# EAGLE design faun-node-connector (EAGLE 7.2.0)
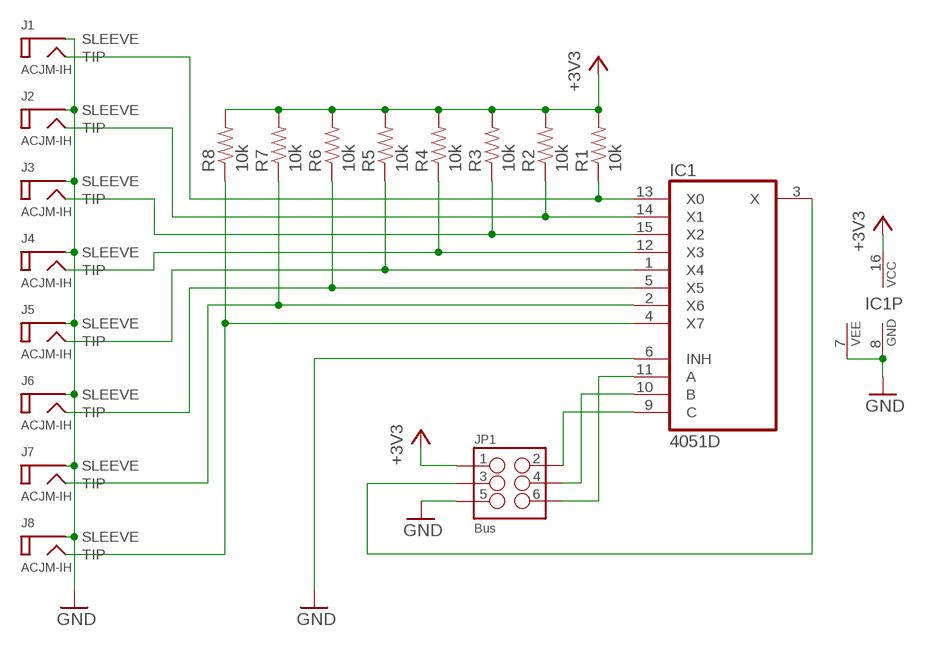
[diagram p0: schematic, sheet 1]

## Parts
IC1  4051D  [SO16]
J1  ACJM-IH  [ACJM-IH]
J2  ACJM-IH  [ACJM-IH]
J3  ACJM-IH  [ACJM-IH]
J4  ACJM-IH  [ACJM-IH]
J5  ACJM-IH  [ACJM-IH]
J6  ACJM-IH  [ACJM-IH]
J7  ACJM-IH  [ACJM-IH]
J8  ACJM-IH  [ACJM-IH]
JP1  Bus  M03X22X3_SILK_SM  [2X3]
R1  10k  RESISTOR1206  [1206]
R2  10k  RESISTOR1206  [1206]
R3  10k  RESISTOR1206  [1206]
R4  10k  RESISTOR1206  [1206]
R5  10k  RESISTOR1206  [1206]
R6  10k  RESISTOR1206  [1206]
R7  10k  RESISTOR1206  [1206]
R8  10k  RESISTOR1206  [1206]

## Nets
GND: IC1.6(INH) IC1.7(VEE) IC1.8(GND) J1.SLEEVE@1(SLEEVE) J1.SLEEVE@2(SLEEVE) J2.SLEEVE@1(SLEEVE) J2.SLEEVE@2(SLEEVE) J3.SLEEVE@1(SLEEVE) J3.SLEEVE@2(SLEEVE) J4.SLEEVE@1(SLEEVE) J4.SLEEVE@2(SLEEVE) J5.SLEEVE@1(SLEEVE) J5.SLEEVE@2(SLEEVE) J6.SLEEVE@1(SLEEVE) J6.SLEEVE@2(SLEEVE) J7.SLEEVE@1(SLEEVE) J7.SLEEVE@2(SLEEVE) J8.SLEEVE@1(SLEEVE) J8.SLEEVE@2(SLEEVE) JP1.5
N$1: IC1.13(X0) J1.TIP@1(TIP) J1.TIP@2(TIP) R1.1
N$2: IC1.14(X1) J2.TIP@1(TIP) J2.TIP@2(TIP) R2.1
N$3: IC1.15(X2) J3.TIP@1(TIP) J3.TIP@2(TIP) R3.1
N$4: IC1.12(X3) J4.TIP@1(TIP) J4.TIP@2(TIP) R4.1
N$5: IC1.1(X4) J5.TIP@1(TIP) J5.TIP@2(TIP) R5.1
N$6: IC1.5(X5) J6.TIP@1(TIP) J6.TIP@2(TIP) R6.1
N$7: IC1.2(X6) J7.TIP@1(TIP) J7.TIP@2(TIP) R7.1
N$8: IC1.4(X7) J8.TIP@1(TIP) J8.TIP@2(TIP) R8.1
N$9: IC1.9(C) JP1.2
N$10: IC1.10(B) JP1.4
N$11: IC1.11(A) JP1.6
N$12: IC1.3(X) JP1.3
VCC: IC1.16(VCC) JP1.1 R1.2 R2.2 R3.2 R4.2 R5.2 R6.2 R7.2 R8.2 ; supply symbol labelled +3V3

## Library data of the parts
IC1 = 40xx:4051: 8-channel ANALOG MULTIPLEXER
J1-J8 = faun:ACJM-IH: 1/4” (6.35mmø) Jack, Horizontal PCB mount, Plastic housing and Bezel with threaded Metal nut.
JP1 = SparkFun-Connectors:M03X2: 2x3 .1" header. Shrouded, with keying- CONN-10681 SMT- CONN-11415 Pogo pins- HW-11044
R1-R8 = SparkFun-Resistors:RESISTOR: Resistor Basic schematic elements and footprints for 0603, 1206, and PTH resistors.

## Board
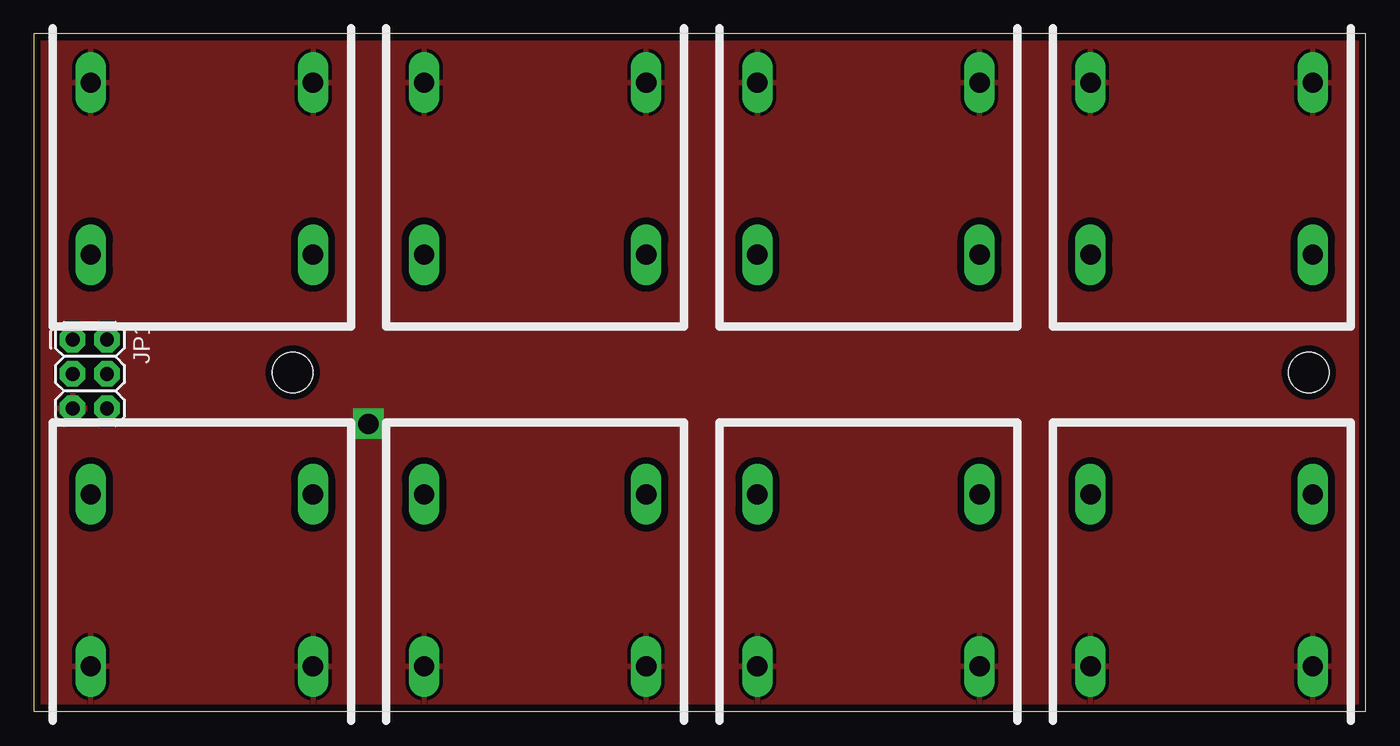
[diagram p1: board, top side]
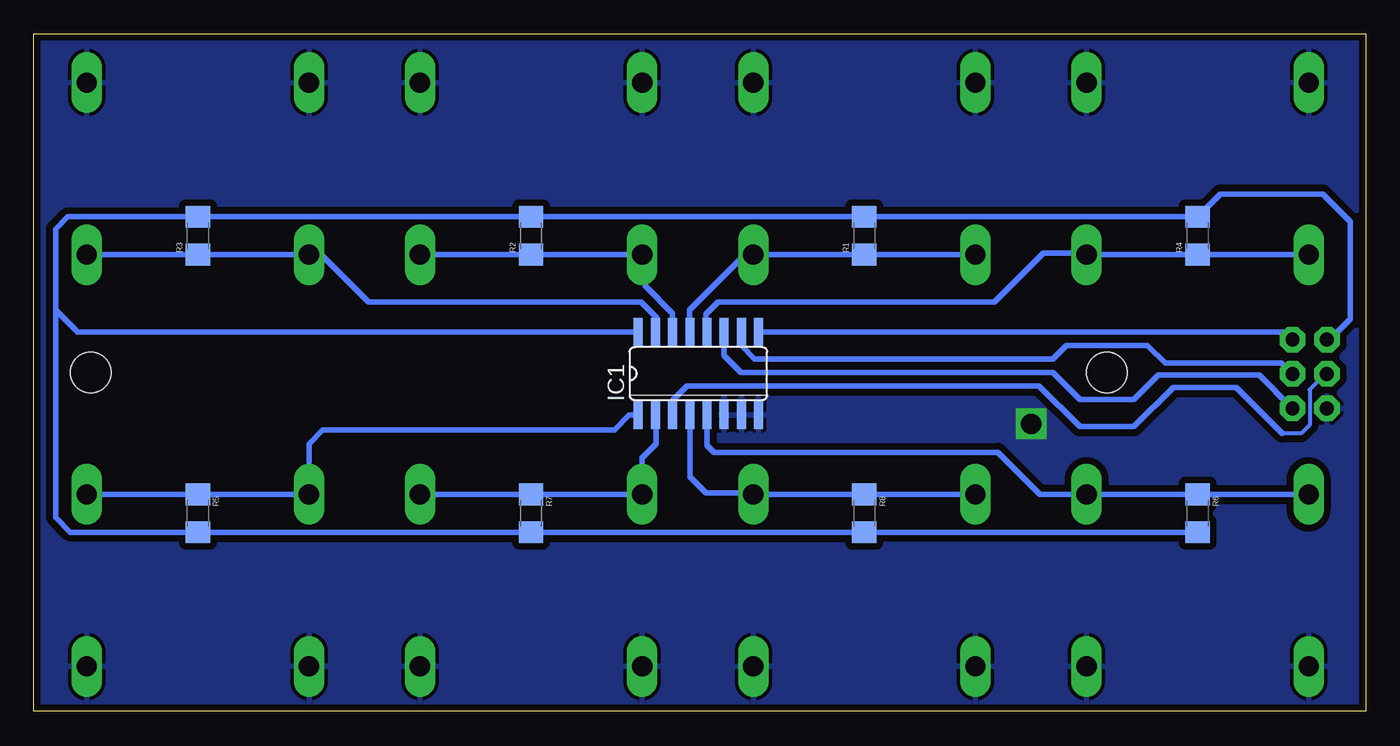
[diagram p2: board, bottom side, seen from below]

Size 98.3 x 50 mm. Coordinates in mm from the lower left corner, seen from the top.
Outline: 0,0 98.3,0 98.3,50 0,50 0,0
Copper layers (1*16): Top 0.035mm / dielectric 1.5mm / Bottom 0.035mm
Design rules "SeeedStudio_2layer_DRU_no_angle_20140221": minimum track width 6mil, minimum drill 12mil, track to track 6mil, track to pad 6mil, pad to pad 6mil, via to via 6mil, smd to smd 0mil, copper to edge 10mil, drill to drill 10mil, minimum pad ring 10mil, minimum via ring 6mil, stop-mask expansion 2mil, vias tented up to drill 100mil, thermal gap 10mil
Holes 3 mm at 94.1,25 19.1,25

### Footprints (pad centres in the part's own frame; a part is rotated, then mirrored left to right if it is on the bottom)
SO16 = smd 0.66 x 2.032: 1 -4.445,-3.073; 2 -3.175,-3.073; 3 -1.905,-3.073; 4 -0.635,-3.073; 5 0.635,-3.073; 6 1.905,-3.073; 7 3.175,-3.073; 8 4.445,-3.073; 9 4.445,3.073; 10 3.175,3.073; 11 1.905,3.073; 12 0.635,3.073; 13 -0.635,3.073; 14 -1.905,3.073; 15 -3.175,3.073; 16 -4.445,3.073
ACJM-IH = drill 1.5 long: SLEEVE@1 0,8.2; SLEEVE@2 0,-8.2; TIP@1 -12.7,8.2; TIP@2 -12.7,-8.2
2X3 = drill 1.016 pad 1.88 octagon: 1 0,0; 2 0,2.54; 3 2.54,0; 4 2.54,2.54; 5 5.08,0; 6 5.08,2.54
1206 = smd 1.6 x 1.8: 1 -1.4,0; 2 1.4,0

### Placement (x,y rotation side)
IC1  49.25,24.92 0 bottom
J1  37,46.4 90 top
J2  61.6,46.4 90 top
J3  86.2,46.4 90 top
J4  12.4,46.4 90 top
J5  86.2,3.3 270 top
J6  12.4,3.3 270 top
J7  61.6,3.3 270 top
J8  37,3.3 270 top
JP1  2.86,27.43 270 top
R1  37,35.1 90 bottom
R2  61.6,35.1 90 bottom
R3  86.2,35.1 90 bottom
R4  12.4,35.1 90 bottom
R5  86.2,14.6 270 bottom
R6  12.4,14.6 270 bottom
R7  61.6,14.6 270 bottom
R8  37,14.6 270 bottom

### Tracks (layer width: path | path; a pad name or v marks a point on that pad's centre or on a via)
GND  (via drill 1.5)
  other vias: 24.7,21.2
  pour Bottom (isolate 0.5): 101.5,62 101.2,-10.6 -5.3,-10.3 -5.3,61.7
  pour Top (isolate 0.5): 110.2,62.3 109.9,-10.3 -15.5,-9.7 -15.5,62.3
N$1
  Bottom 0.406: J1.TIP@1 R1.1 J1.TIP@2 45.8,33.7 49.9,29.6 49.9,28.01 IC1.13
N$2
  Bottom 0.406: J2.TIP@2 R2.1 J2.TIP@1 53.2,33.5 53.2,31.4 51.16,29.35 IC1.14
N$3
  Bottom 0.406: J3.TIP@2 R3.1 J3.TIP@1 77.1,33.7 73.6,30.2 53.5,30.2 52.3,29 52.3,28.12 IC1.15
N$4
  Bottom 0.406: J4.TIP@1 R4.1 J4.TIP@2 20.7,33.8 23.8,33.8 27.4,30.2 47.8,30.2 48.7,29.3 48.7,28.08 IC1.12
N$5
  Bottom 0.406: J5.TIP@1 R5.1 J5.TIP@2 78,19.73 76.97,20.75 55.45,20.75 54.35,21.85 IC1.1
N$6
  Bottom 0.406: J6.TIP@2 R6.1 J6.TIP@1 24.05,16 27.15,19.1 48.1,19.1 48.62,19.61 IC1.5
N$7
  Bottom 0.406: J7.TIP@1 R7.1 J7.TIP@2 53.4,18.7 52.38,19.73 52.38,21.8 IC1.2
N$8
  Bottom 0.406: J8.TIP@2 R8.1 J8.TIP@1 45.3,16.1 48.7,16.1 49.88,17.29 IC1.4
N$9
  Bottom 0.406: IC1.9 5.96,27.99 JP1.2
N$10
  Bottom 0.406: JP1.4 6.21,25.7 14.8,25.7 16.1,27 22.1,27 23.1,26 45.1,26 46.08,26.98 IC1.10
N$11
  Bottom 0.406: JP1.6 7.85,24.8 15.3,24.8 17.1,23 21.1,23 23.1,25 46.1,25 47.34,26.24 IC1.11
N$12
  Bottom 0.305: 2.92,24.86 3.03,24.83 4.13,23.73 4.13,21.14 4.75,20.51 6.15,20.51
  Bottom 0.406: 2.92,24.86 JP1.3 | 6.15,20.51 9.54,23.9 14.2,23.9 17.1,21 21.1,21 24.1,24 50.1,24 51.16,22.95 IC1.3
VCC
  Bottom 0.406: R6.2 R8.2 R7.2 R5.2 95.6,13.2 96.7,14.3 96.7,29.6 | JP1.1 2.65,27.43 1.12,28.95 1.12,36.12 3.18,38.17 10.72,38.17 R4.2 R1.2 R2.2 R3.2 95.8,36.5 96.7,35.6 96.7,29.6 | 96.7,29.6 95.22,28.12 95.09,27.99 IC1.16